# EAGLE schematic ESP32_Display_2.1(K)_Main_V1.0 (EAGLE 9.6.2)
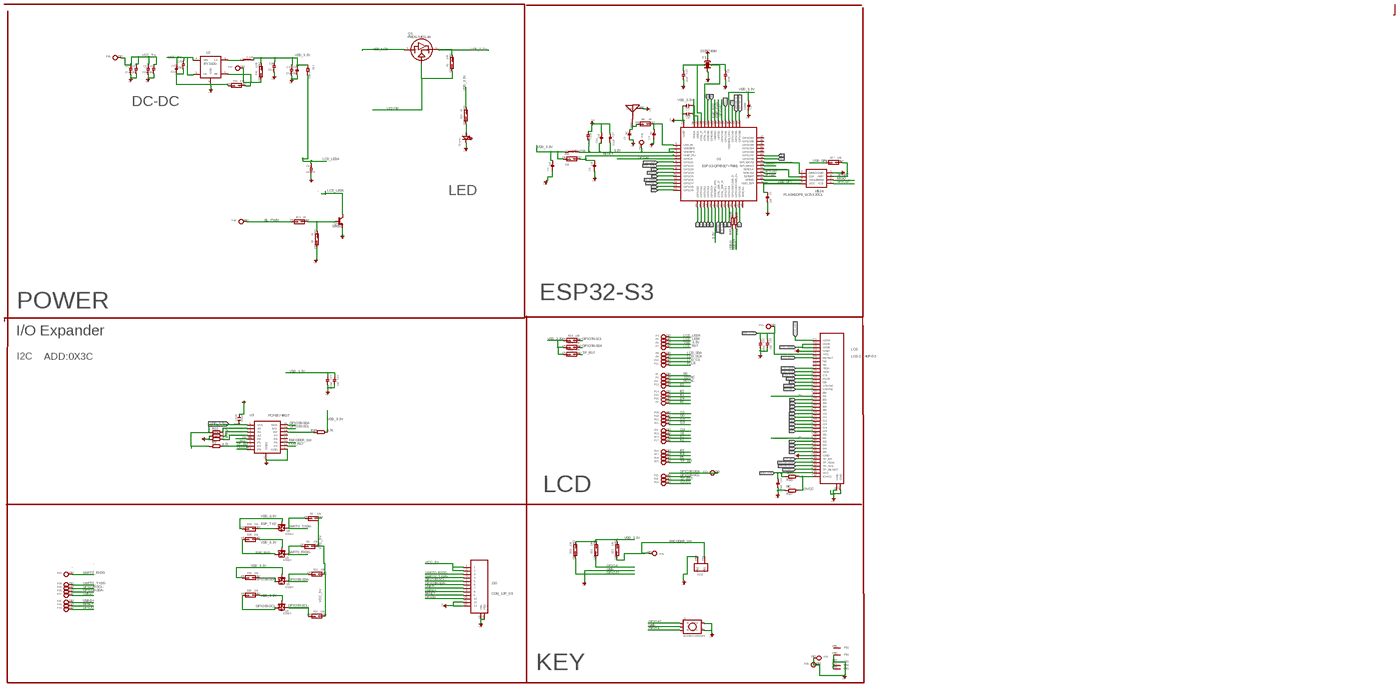
[diagram p0: schematic, sheet 1, overview]
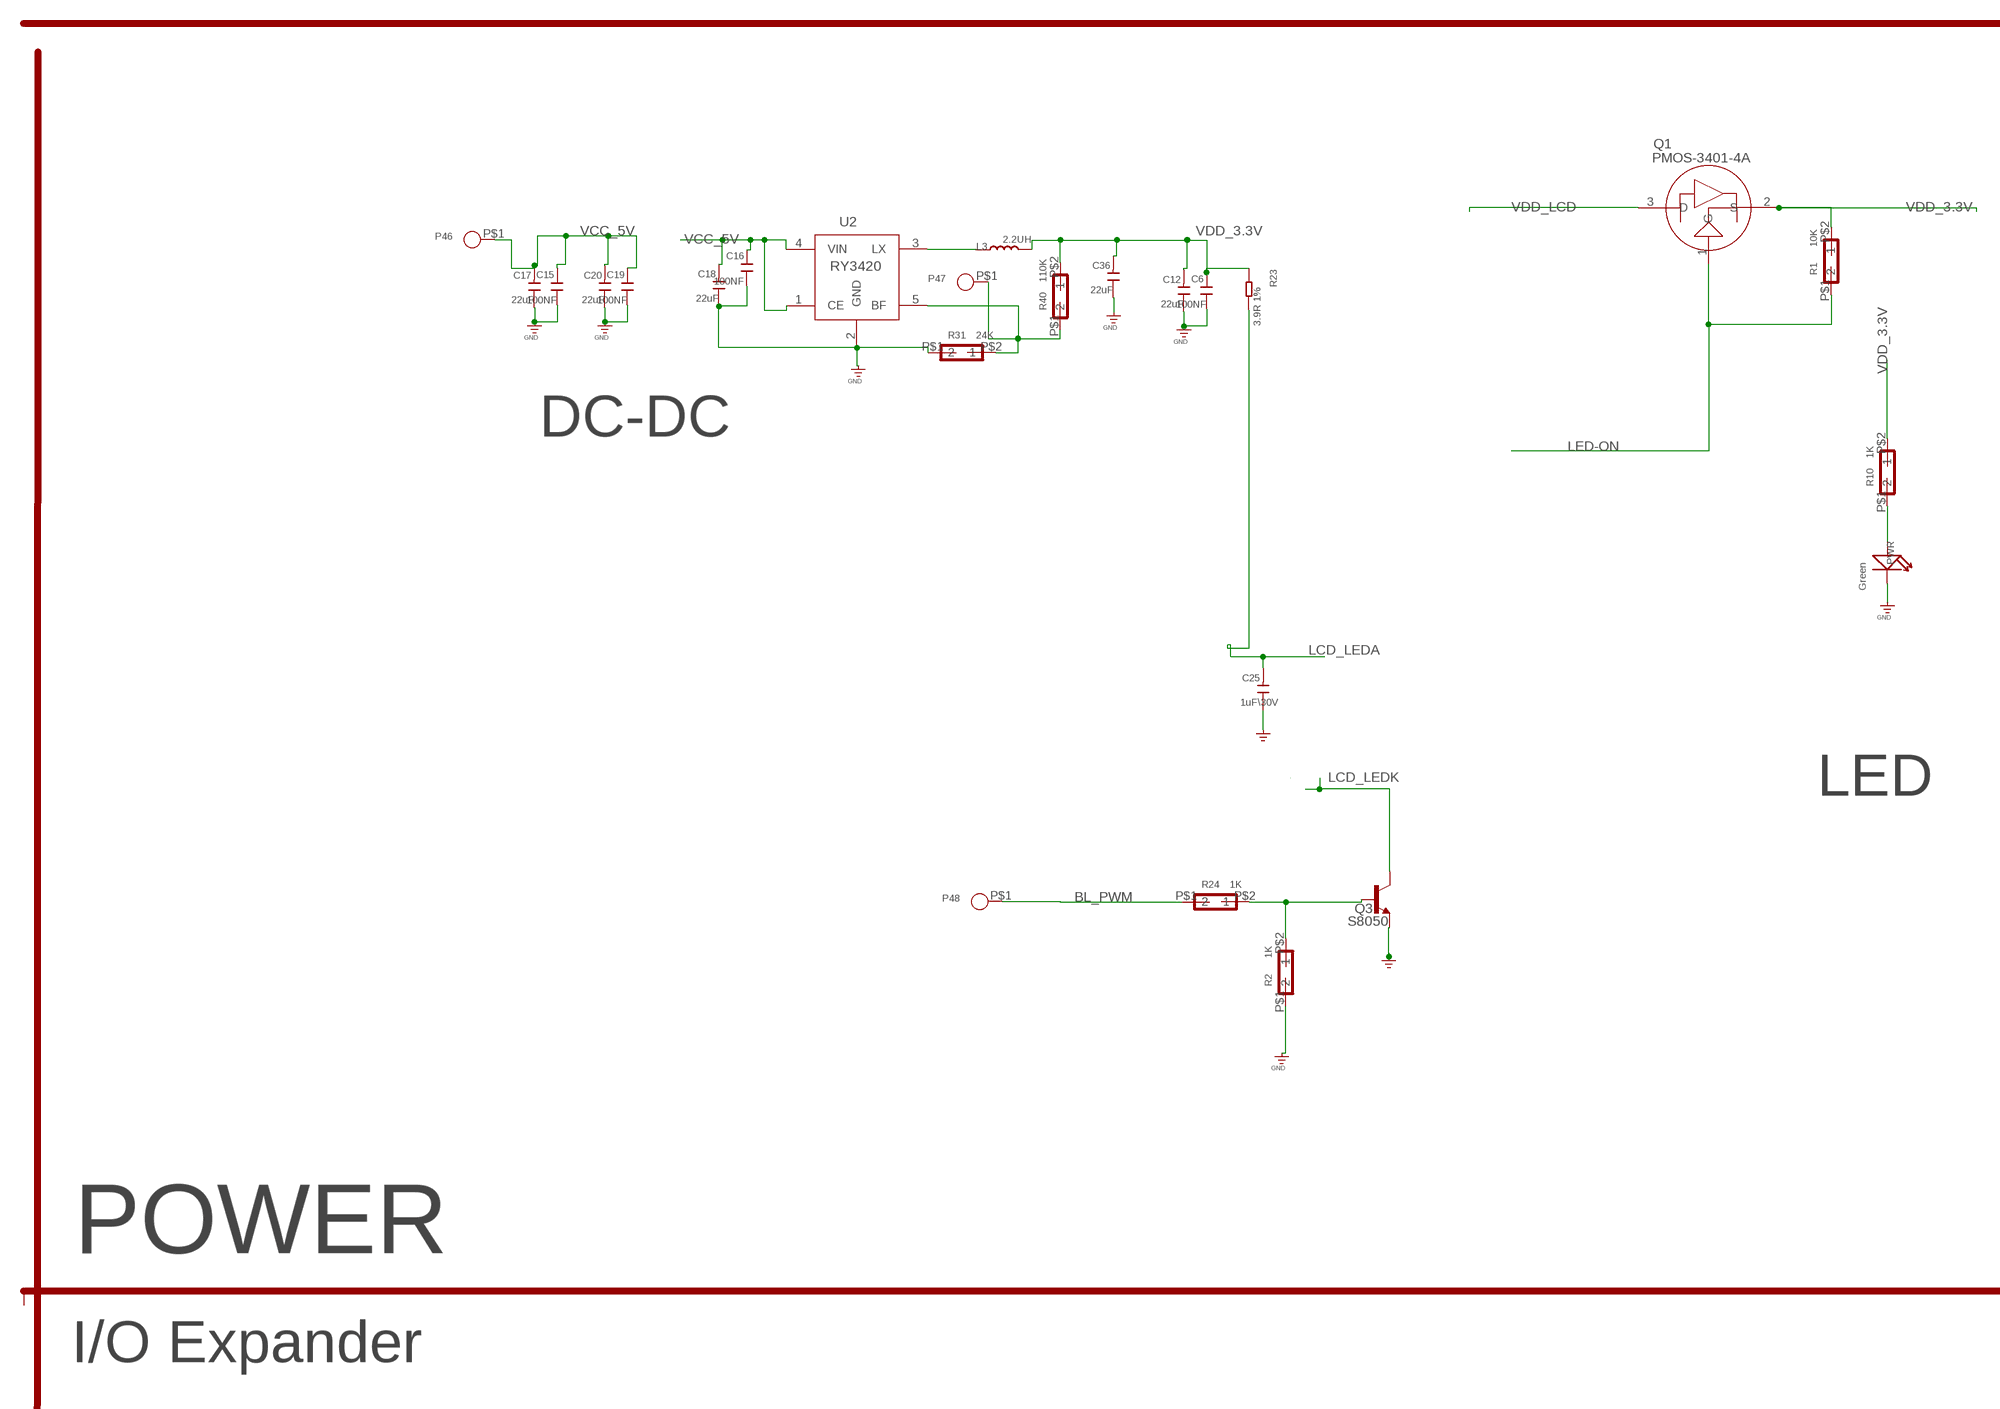
[diagram p1: schematic, sheet 1, part 1 of 5]
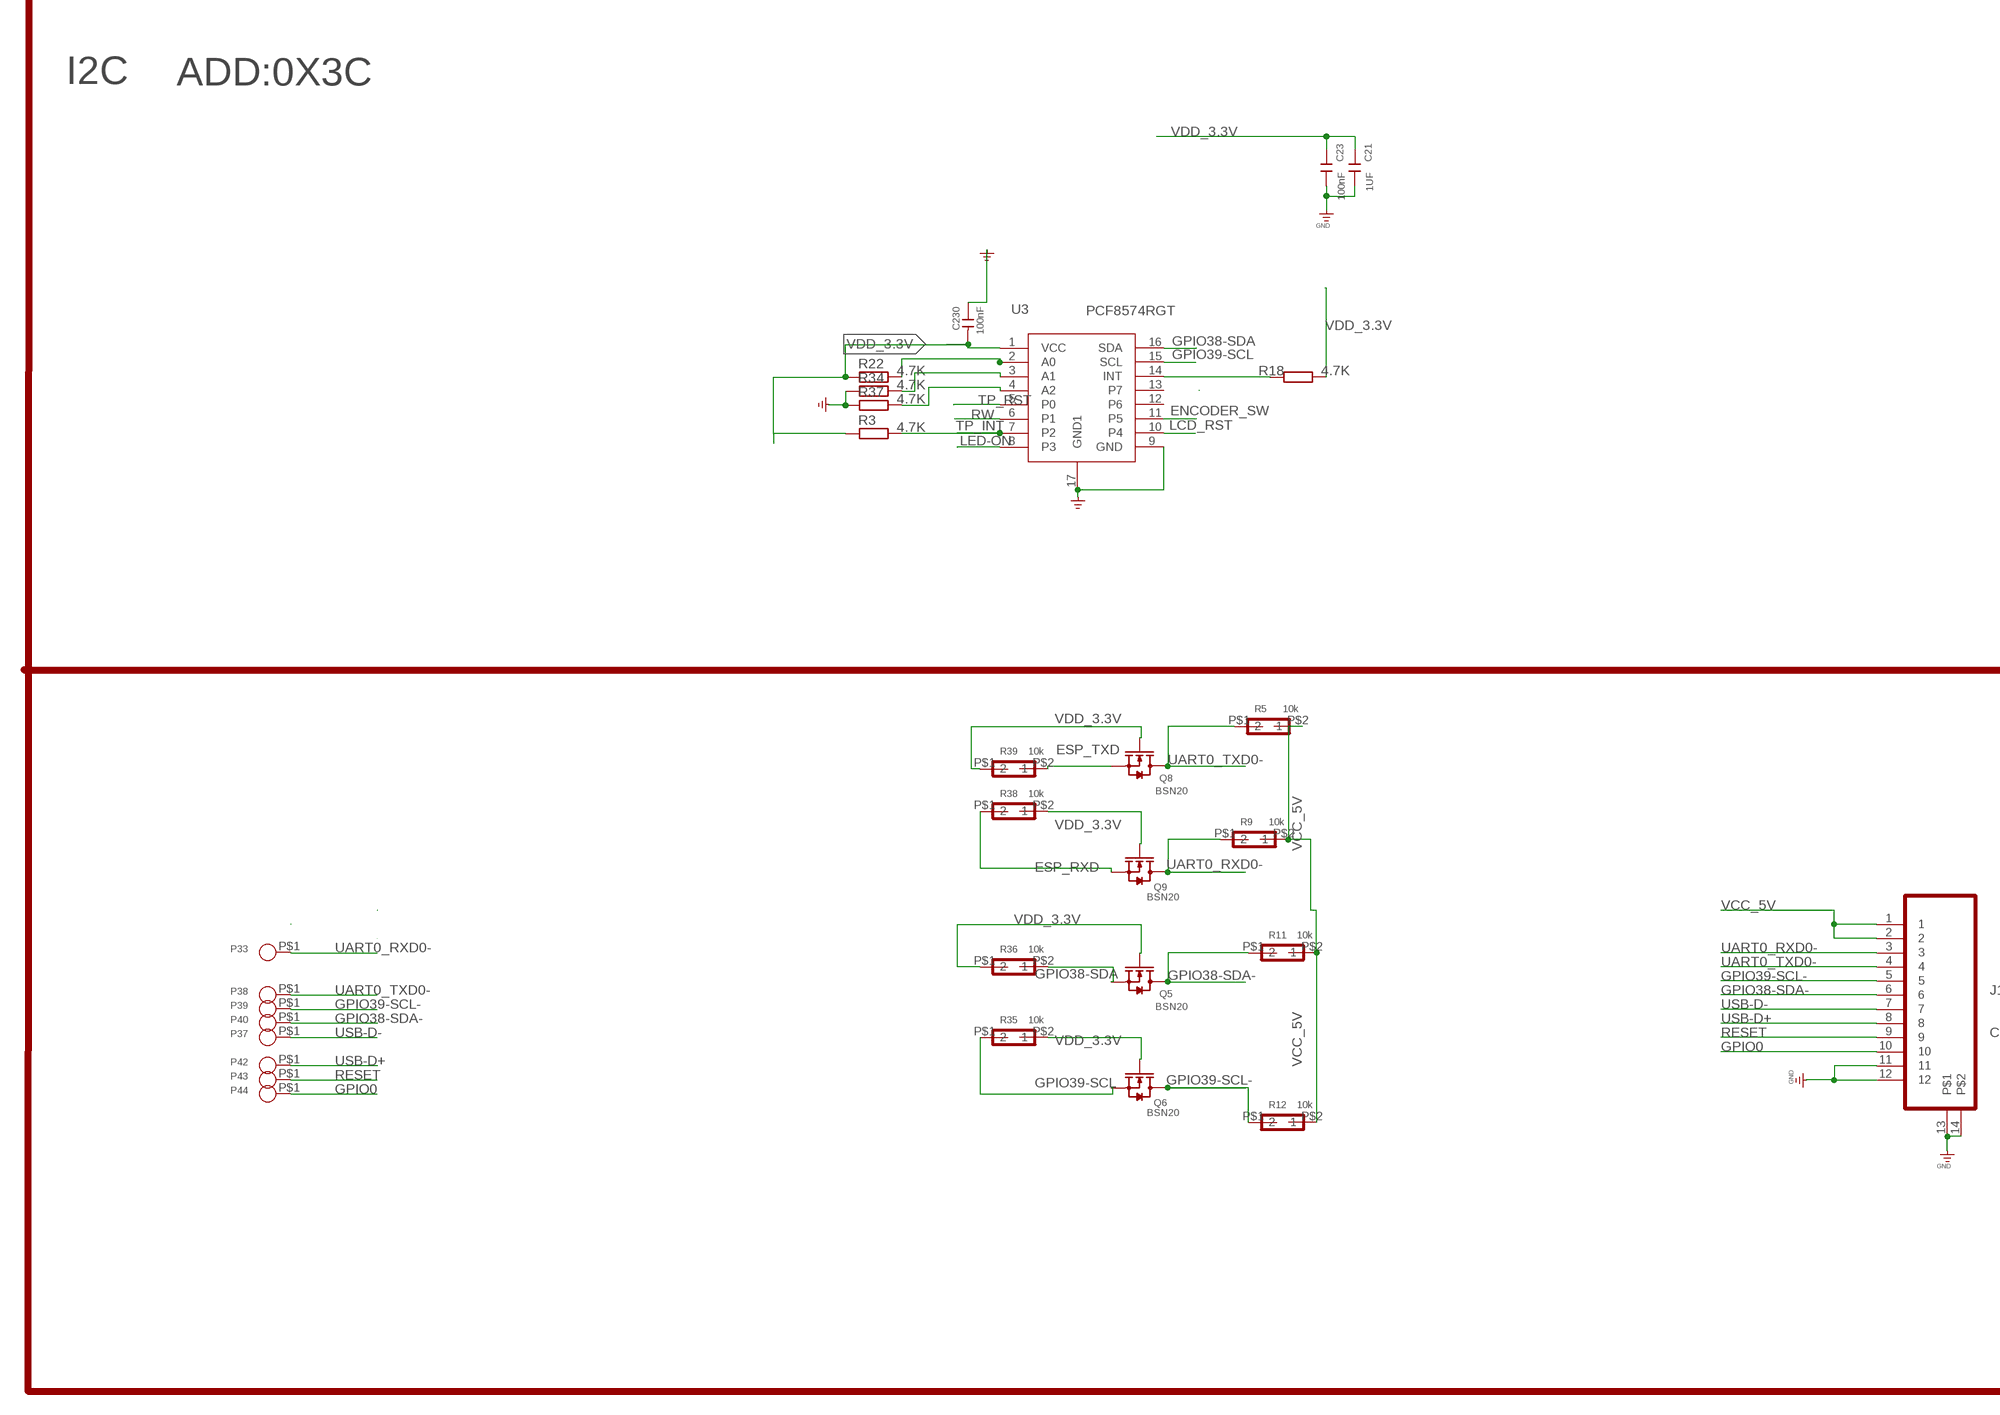
[diagram p2: schematic, sheet 1, part 2 of 5]
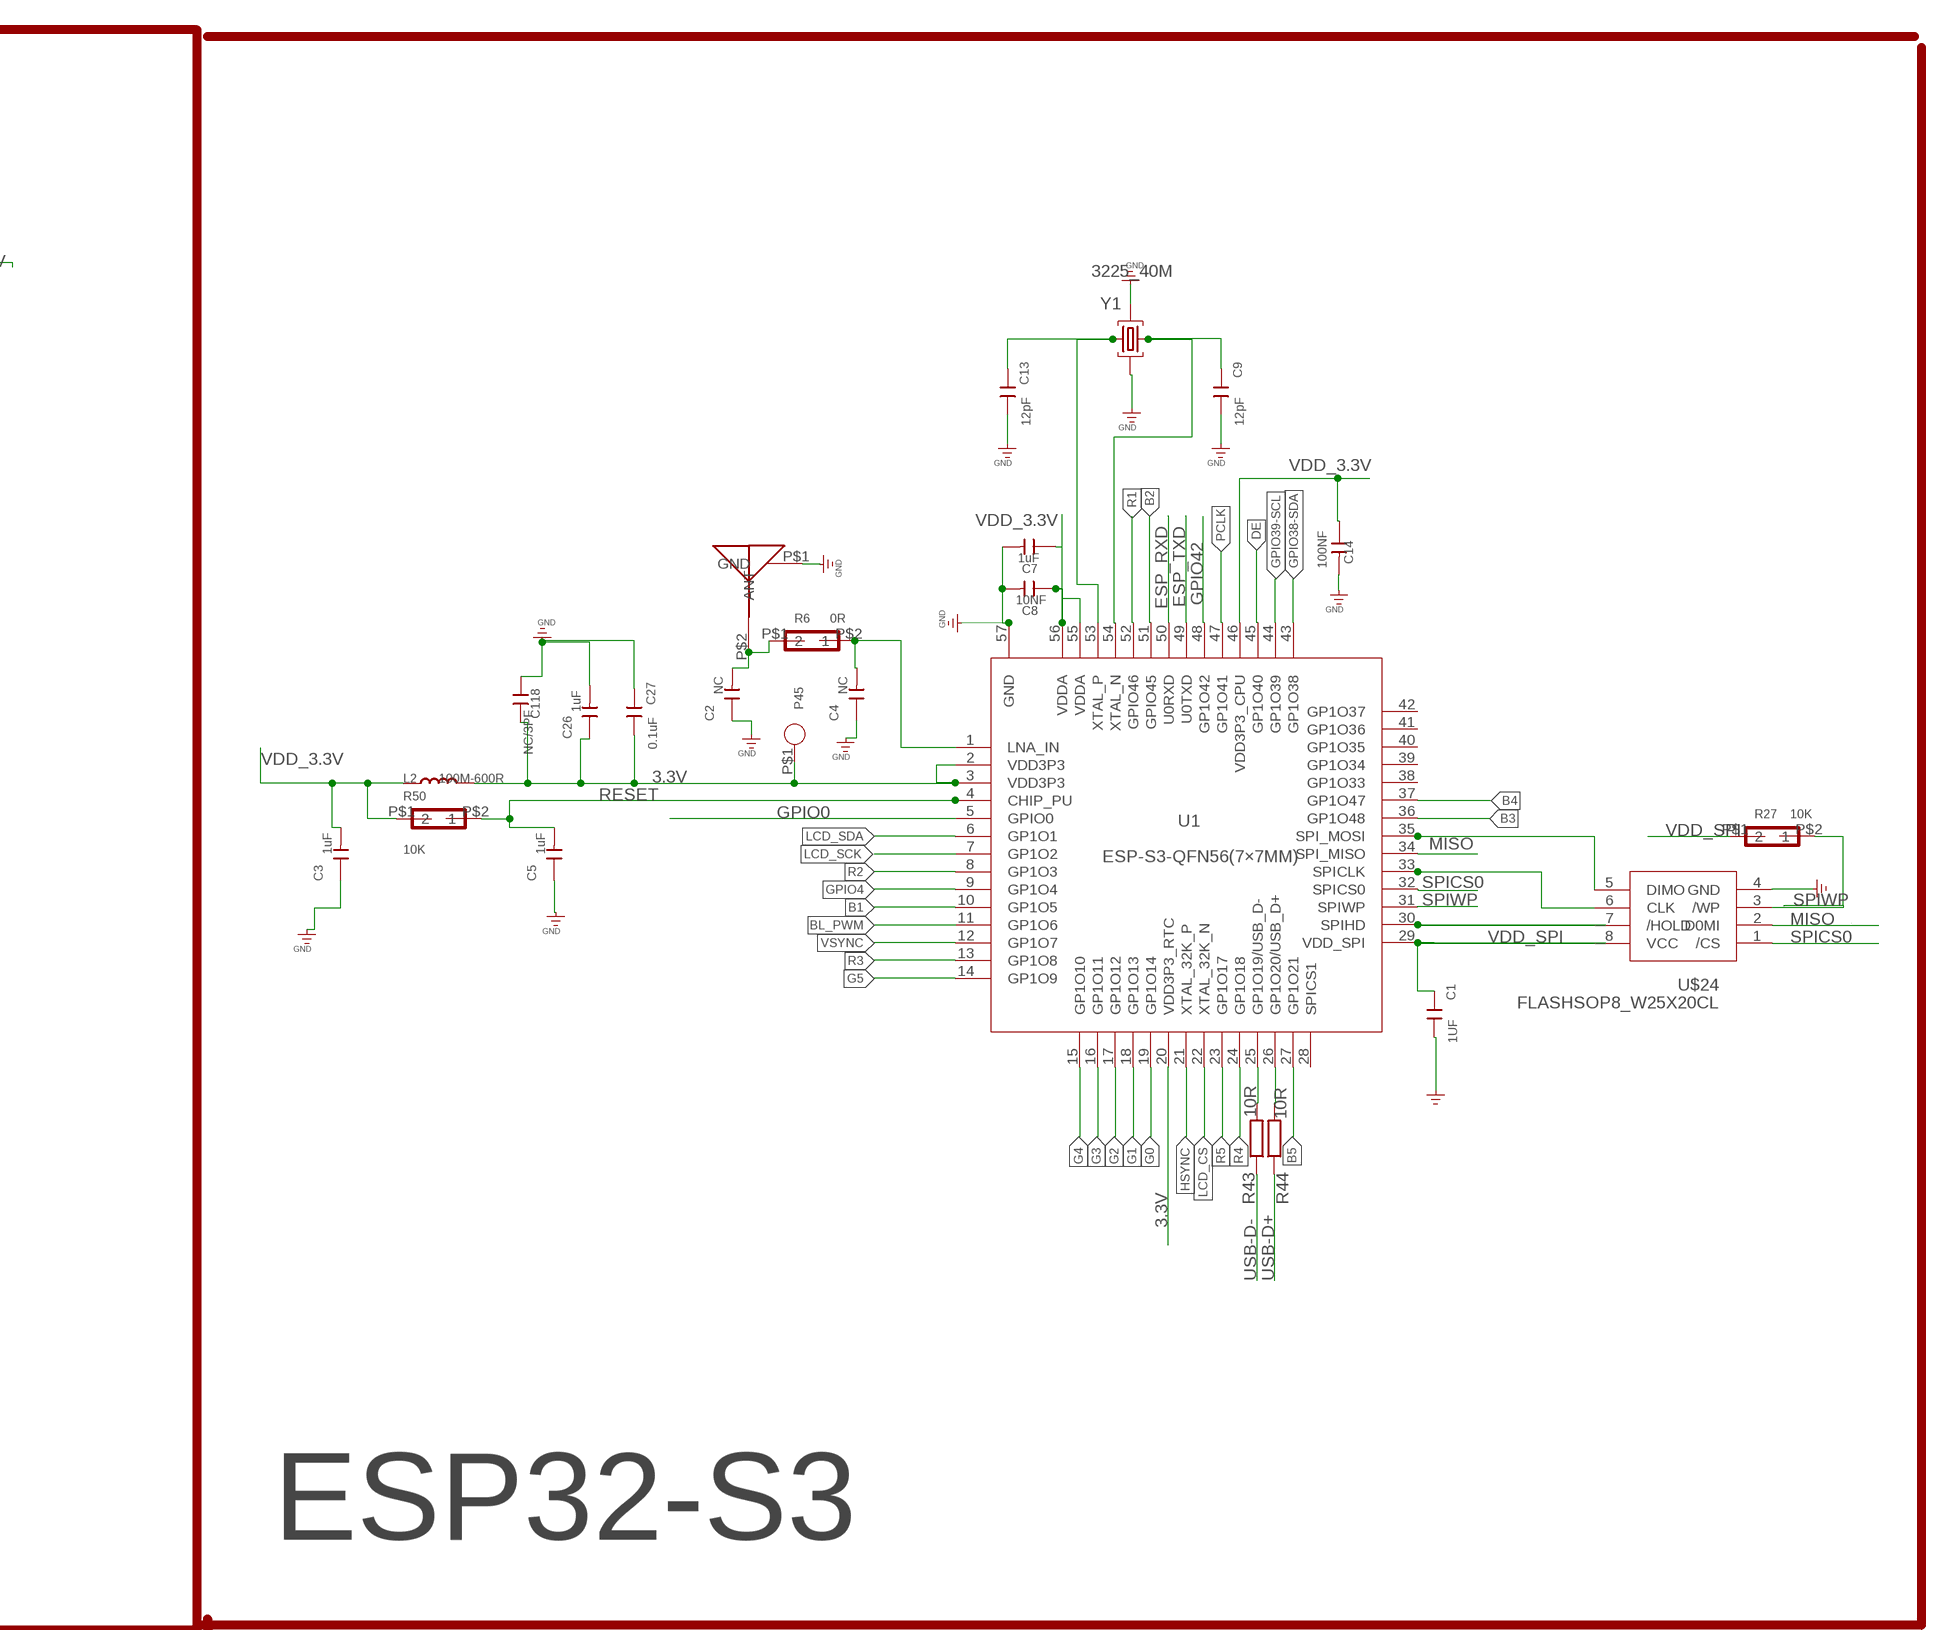
[diagram p3: schematic, sheet 1, part 3 of 5]
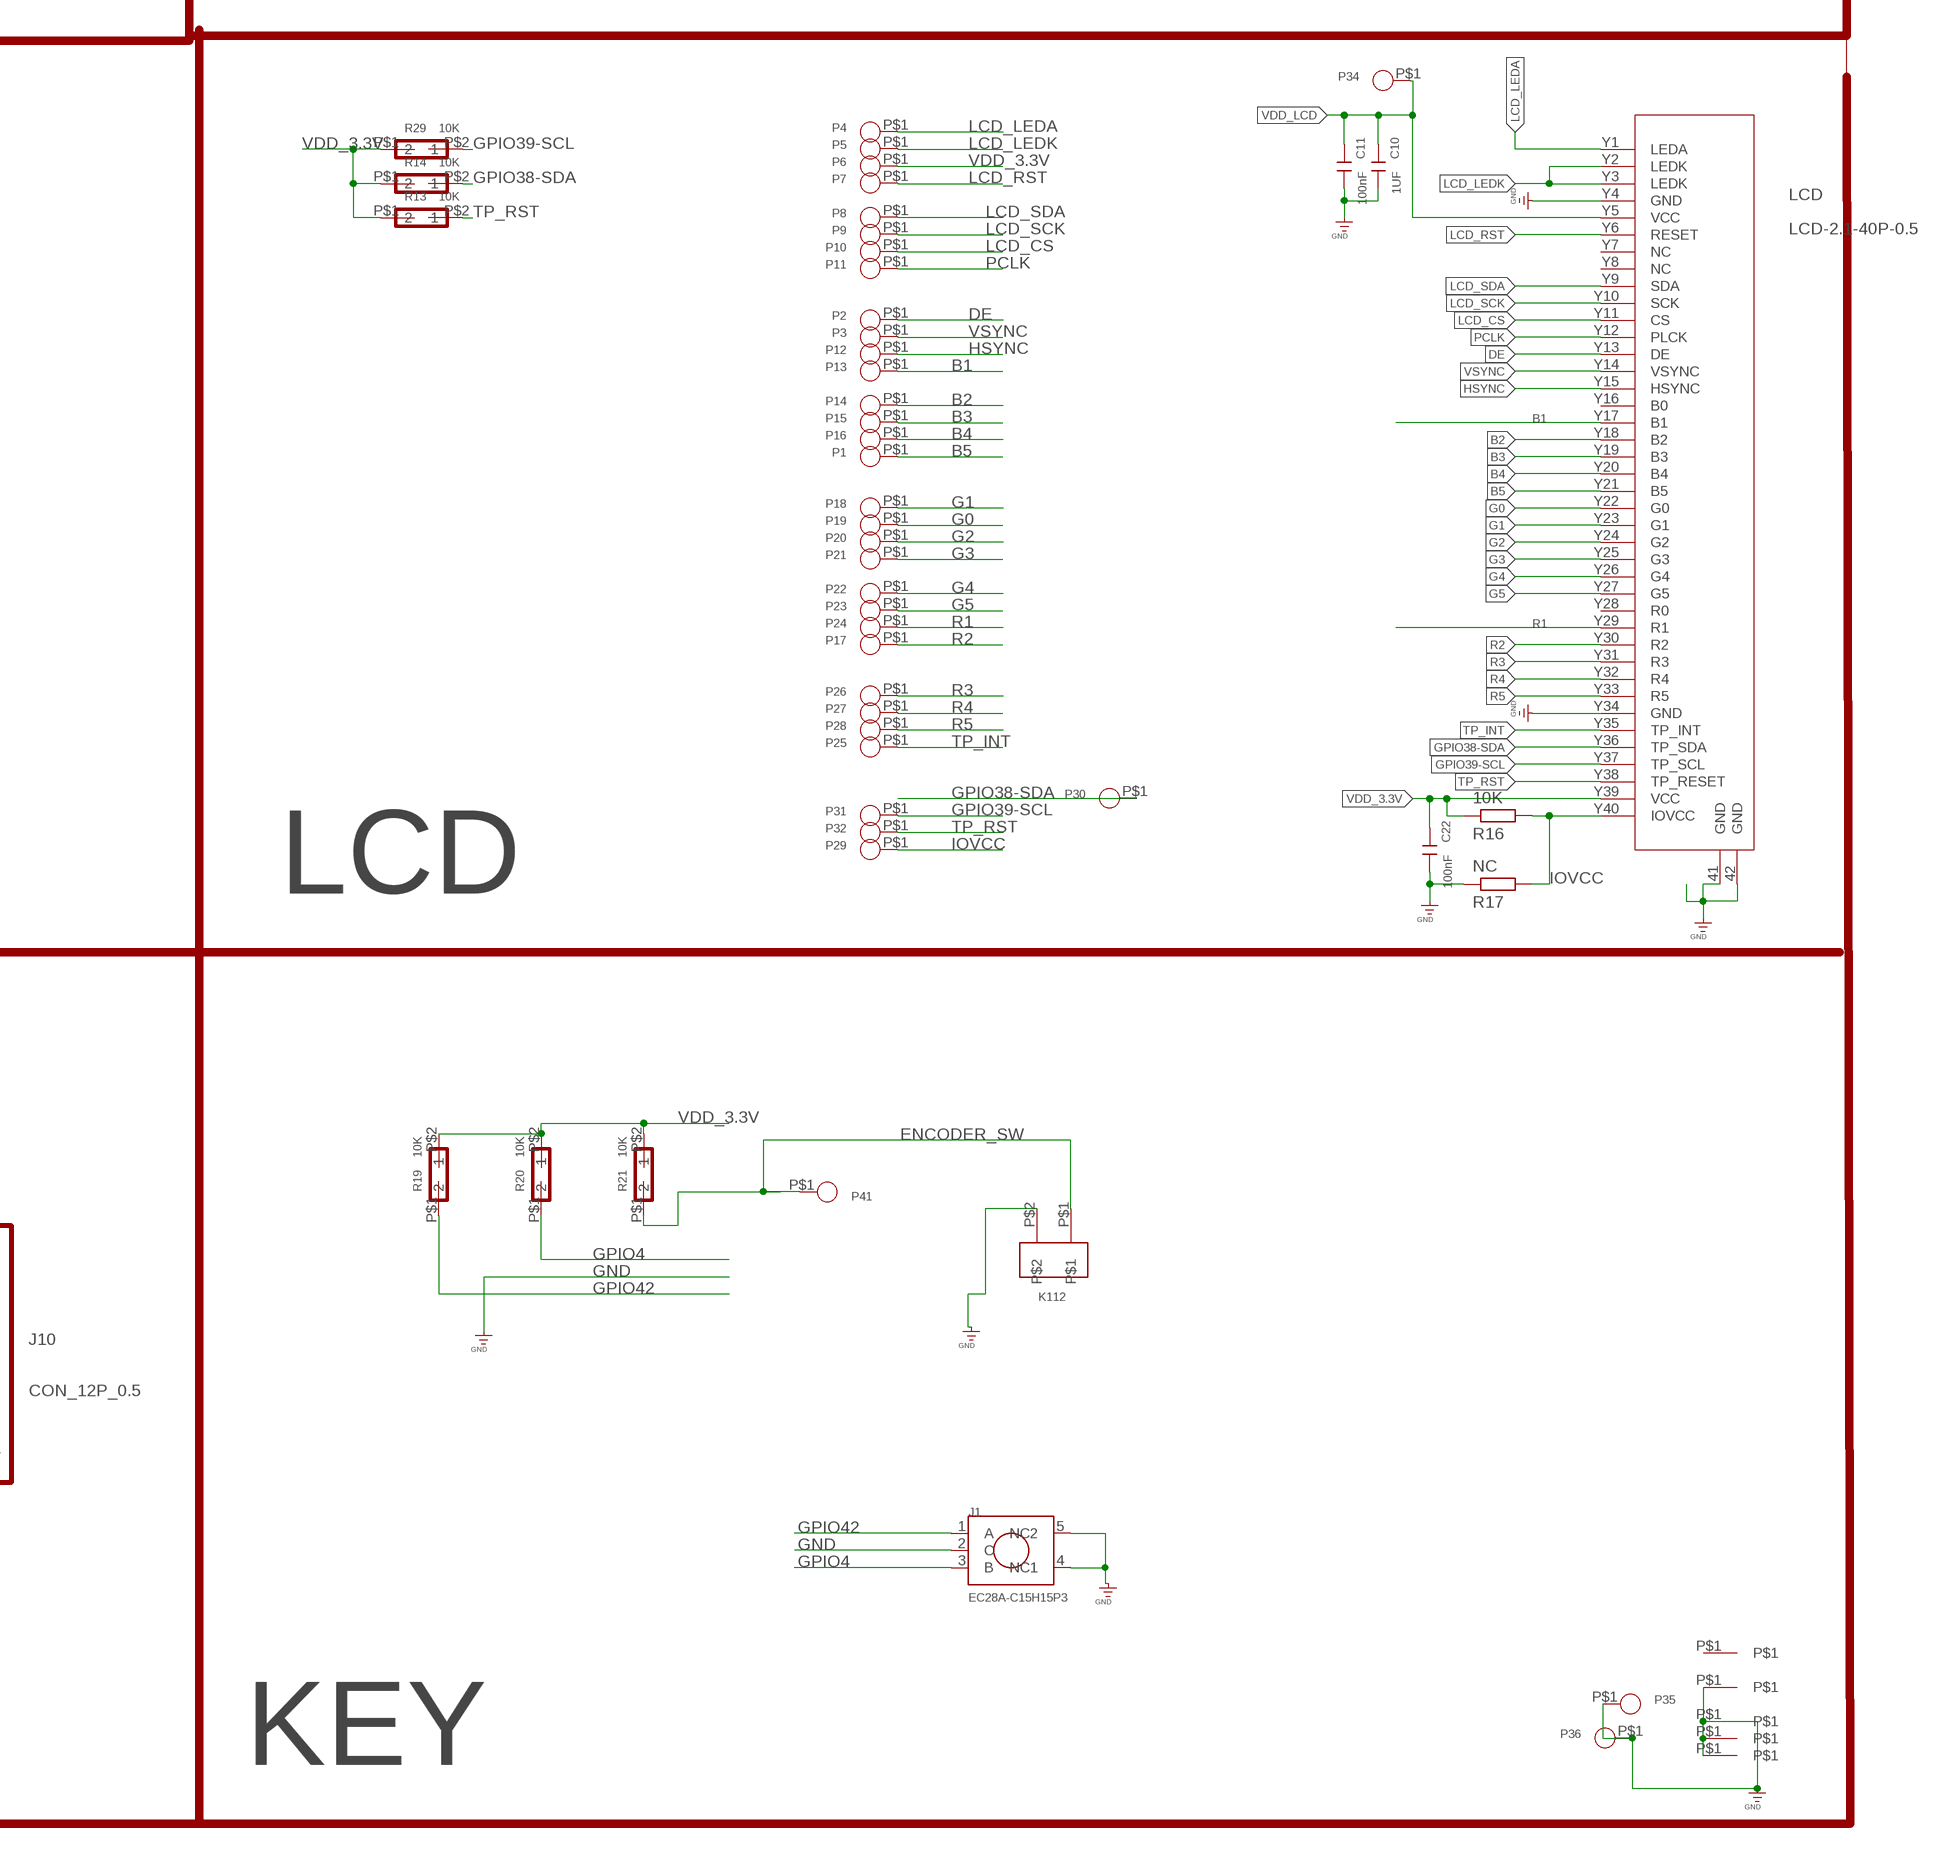
[diagram p4: schematic, sheet 1, part 4 of 5]
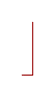
[diagram p5: schematic, sheet 1, part 5 of 5]

## Parts
ANT  BT_ANT  [BT_ANT]
C1  1UF  C0402_W  [0402]
C2  NC  CAPC0402-1  [C0402]
C3  1uF  CAPC0402-1  [C0402]
C4  NC  CAPC0402-1  [C0402]
C5  1uF  CAPC0402-1  [C0402]
C6  100NF  C0603  [0603]
C7  1uF  C-0603  [C0603]
C8  10NF  C-0603  [C0603]
C9  12pF  C0402_W  [0402]
C10  1UF  C0402_W  [0402]
C11  100nF  C0402_W  [0402]
C12  22uF  C0805  [0805]
C13  12pF  C0402_W  [0402]
C14  100NF  C-0603  [C0603]
C15  100NF  C0603  [0603]
C16  100NF  C0603  [0603]
C17  22uF  C0805  [0805]
C18  22uF  C0805  [0805]
C19  100NF  C0603  [0603]
C20  22uF  C0805  [0805]
C21  1UF  C0402_W  [0402]
C22  100nF  C0402_W  [0402]
C23  100nF  C0402_W  [0402]
C25  1uF\30V  C0805  [0805]
C26  1uF  CAPC0402-1  [C0402]
C27  0.1uF  C0402_W  [0402]
C36  22uF  C0805  [0805]
C118  NC/3PF  C0603  [0603]
C230  100nF  CAPC0603  [C0603]
J1  EC28A-C15H15P3  [EC28A-C15H15P3]
J10  CON_12P_0.5  [0.5MM-12P]
K112  BUTTON_2P  [BUTTON_2P]
L2  100M-600R  L0603  [L0603]
L3  2.2UH  LL0420  [L0420]
LCD  LCD-2.1-40P-0.5  [0.5MM-40P]
P1  PADPAD-1.0MM  [PAD-1.0MM]
P2  PADPAD-1.0MM  [PAD-1.0MM]
P3  PADPAD-1.0MM  [PAD-1.0MM]
P4  PADPAD-1.0MM  [PAD-1.0MM]
P5  PADPAD-1.0MM  [PAD-1.0MM]
P6  PADPAD-1.0MM  [PAD-1.0MM]
P7  PADPAD-1.0MM  [PAD-1.0MM]
P8  PADPAD-1.0MM  [PAD-1.0MM]
P9  PADPAD-1.0MM  [PAD-1.0MM]
P10  PADPAD-1.0MM  [PAD-1.0MM]
P11  PADPAD-1.0MM  [PAD-1.0MM]
P12  PADPAD-1.0MM  [PAD-1.0MM]
P13  PADPAD-1.0MM  [PAD-1.0MM]
P14  PADPAD-1.0MM  [PAD-1.0MM]
P15  PADPAD-1.0MM  [PAD-1.0MM]
P16  PADPAD-1.0MM  [PAD-1.0MM]
P17  PADPAD-1.0MM  [PAD-1.0MM]
P18  PADPAD-1.0MM  [PAD-1.0MM]
P19  PADPAD-1.0MM  [PAD-1.0MM]
P20  PADPAD-1.0MM  [PAD-1.0MM]
P21  PADPAD-1.0MM  [PAD-1.0MM]
P22  PADPAD-1.0MM  [PAD-1.0MM]
P23  PADPAD-1.0MM  [PAD-1.0MM]
P24  PADPAD-1.0MM  [PAD-1.0MM]
P25  PADPAD-1.0MM  [PAD-1.0MM]
P26  PADPAD-1.0MM  [PAD-1.0MM]
P27  PADPAD-1.0MM  [PAD-1.0MM]
P28  PADPAD-1.0MM  [PAD-1.0MM]
P29  PADPAD-1.0MM  [PAD-1.0MM]
P30  PADPAD-1.0MM  [PAD-1.0MM]
P31  PADPAD-1.0MM  [PAD-1.0MM]
P32  PADPAD-1.0MM  [PAD-1.0MM]
P33  PADPAD-1.0MM  [PAD-1.0MM]
P34  PADPAD-1.0MM  [PAD-1.0MM]
P35  PADPAD-1.0MM  [PAD-1.0MM]
P36  PADPAD-1.0MM  [PAD-1.0MM]
P37  PADPAD-1.0MM  [PAD-1.0MM]
P38  PADPAD-1.0MM  [PAD-1.0MM]
P39  PADPAD-1.0MM  [PAD-1.0MM]
P40  PADPAD-1.0MM  [PAD-1.0MM]
P41  PADPAD-1.0MM  [PAD-1.0MM]
P42  PADPAD-1.0MM  [PAD-1.0MM]
P43  PADPAD-1.0MM  [PAD-1.0MM]
P44  PADPAD-1.0MM  [PAD-1.0MM]
P45  PADPAD-1.0MM  [PAD-1.0MM]
P46  PADPAD-1.0MM  [PAD-1.0MM]
P47  PADPAD-1.0MM  [PAD-1.0MM]
P48  PADPAD-1.0MM  [PAD-1.0MM]
PWR  Green  LED'0603'  [LED-0603]
Q1  PMOS-3401-4A  P-MOS-SOT23  [SOT-23]
Q3  S8050  SPARKFUN_TRANSISTOR_NPNSOT23  [SPARKFUN_SOT23]
Q5  BSN20  MOSFET-N'SOT23'  [SOT23]
Q6  BSN20  MOSFET-N'SOT23'  [SOT23]
Q8  BSN20  MOSFET-N'SOT23'  [SOT23]
Q9  BSN20  MOSFET-N'SOT23'  [SOT23]
R1  10K  R0402  [0402]
R2  1K  R0402  [0402]
R3  4.7K  R-EU_R0402  [R0402]
R5  10k  R0402  [0402]
R6  0R  R0402  [0402]
R9  10k  R0402  [0402]
R10  1K  R0402  [0402]
R11  10k  R0402  [0402]
R12  10k  R0402  [0402]
R13  10K  R0402  [0402]
R14  10K  R0402  [0402]
R16  10K  R-EU_R0402  [R0402]
R17  NC  R-EU_R0402  [R0402]
R18  4.7K  R-EU_R0402  [R0402]
R19  10K  R0402  [0402]
R20  10K  R0402  [0402]
R21  10K  R0402  [0402]
R22  4.7K  R-EU_R0402  [R0402]
R23  3.9R 1%  DISCRETE_R-0603  [DISCRETE_R0603]
R24  1K  R0402  [0402]
R27  10K  R0402  [0402]
R29  10K  R0402  [0402]
R31  24K  R0402  [0402]
R34  4.7K  R-EU_R0402  [R0402]
R35  10k  R0402  [0402]
R36  10k  R0402  [0402]
R37  4.7K  R-EU_R0402  [R0402]
R38  10k  R0402  [0402]
R39  10k  R0402  [0402]
R40  110K  R0402  [0402]
R43  10R  R-EU_R0402  [R0402]
R44  10R  R-EU_R0402  [R0402]
R50  10K  R0402  [0402]
U1  ESP-S3-QFN56(7×7MM)  [ESP-S3-QFN56(7×7MM)]
U2  RY3420  HX3406  [SOT23-5]
U3  PCF8574RGT  [QFN16-3*3]
U$9  T-2-1.1  [T-2-1.1]
U$19  T-2-1.1  [T-2-1.1]
U$24  FLASHSOP8_W25X20CL  [FLASHSOP8_SOP8]
U$29  T-2-1.1  [T-2-1.1]
U$30  T-2-1.1  [T-2-1.1]
U$32  T-2-1.1  [T-2-1.1]
Y1  3225_40M  CRYSTAL-3.2-2.5  [CRYSTAL-3.2-2.5]

## Nets
3.3V: C26.1 C27.2 C118.2 L2.2 P45.P$1 U1.2(VDD3P3) U1.3(VDD3P3) U1.20(VDD3P3_RTC)
B1: LCD.Y17(B1) P13.P$1 U1.10(GP1O5)
B2: LCD.Y18(B2) P14.P$1 U1.51(GPIO45)
B3: LCD.Y19(B3) P15.P$1 U1.36(GP1O48)
B4: LCD.Y20(B4) P16.P$1 U1.37(GP1O47)
B5: LCD.Y21(B5) P1.P$1 U1.27(GP1O21)
BL_PWM: P48.P$1 R24.P$1 U1.11(GP1O6)
DE: LCD.Y13(DE) P2.P$1 U1.45(GP1O40)
ENCODER_A: U3.12(P6)
ENCODER_SW: K112.P$1 P41.P$1 R21.P$1 U3.11(P5)
ESP_RXD: Q9.2(S) R38.P$1 U1.50(U0RXD)
ESP_TXD: Q8.2(S) R39.P$2 U1.49(U0TXD)
G0: LCD.Y22(G0) P19.P$1 U1.19(GP1O14)
G1: LCD.Y23(G1) P18.P$1 U1.18(GP1O13)
G2: LCD.Y24(G2) P20.P$1 U1.17(GP1O12)
G3: LCD.Y25(G3) P21.P$1 U1.16(GP1O11)
G4: LCD.Y26(G4) P22.P$1 U1.15(GP1O10)
G5: LCD.Y27(G5) P23.P$1 U1.14(GP1O9)
GND: ANT.P$1(GND) C1.2 C2.1 C3.1 C4.1 C5.1 C6.2 C7.2 C8.2 C9.2 C10.2 C11.2 C12.1 C13.2 C14.2 C15.2 C16.2 C17.1 C18.1 C19.2 C20.1 C21.2 C22.2 C23.2 C25.1 C26.2 C27.1 C36.1 C118.1 C230.1 J1.2(C) J1.4(NC1) J1.5(NC2) J10.11 J10.12 J10.13 J10.14 K112.P$2 LCD.41(GND) LCD.42(GND) LCD.Y4(GND) LCD.Y34(GND) P35.P$1 P36.P$1 PWR.- Q3.2(E) R2.P$1 R17.2 R31.P$1 R34.2 R37.2 U1.57(GND) U2.2(GND) U3.9(GND) U3.17(GND1) U$9.P$1 U$19.P$1 U$24.4(GND) U$29.P$1 U$32.P$1 Y1.2(GND) Y1.4(GND)
GPIO0: J10.10 P44.P$1 U1.5(GPIO0)
GPIO4: J1.3(B) R20.P$1 U1.9(GP1O4)
GPIO38-SDA: LCD.Y36(TP_SDA) P30.P$1 Q5.2(S) R14.P$2 R36.P$2 U1.43(GP1O38) U3.16(SDA)
GPIO38-SDA-: J10.6 P40.P$1 Q5.3(D) R11.P$1
GPIO39-SCL: LCD.Y37(TP_SCL) P31.P$1 Q6.2(S) R29.P$2 R35.P$1 U1.44(GP1O39) U3.15(SCL)
GPIO39-SCL-: J10.5 P39.P$1 Q6.3(D) R12.P$1
GPIO42: J1.1(A) R19.P$1 U1.48(GP1O42)
HSYNC: LCD.Y15(HSYNC) P12.P$1 U1.21(XTAL_32K_P)
IOVCC: LCD.Y40(IOVCC) P29.P$1 R16.1 R17.1
LCD_CS: LCD.Y11(CS) P10.P$1 U1.22(XTAL_32K_N)
LCD_LEDA: C25.2 LCD.Y1(LEDA) P4.P$1 R23.2
LCD_LEDK: LCD.Y2(LEDK) LCD.Y3(LEDK) P5.P$1 Q3.3(C)
LCD_RST: LCD.Y6(RESET) P7.P$1 U3.10(P4)
LCD_SCK: LCD.Y10(SCK) P9.P$1 U1.7(GP1O2)
LCD_SDA: LCD.Y9(SDA) P8.P$1 U1.6(GP1O1)
LED-ON: Q1.1(G) R1.P$1 U3.8(P3)
MISO: U1.34(SPI_MISO) U$24.2(D0MI)
N$3: L3.1 U2.3(LX)
N$4: R22.1 U3.2(A0)
N$5: PWR.+ R10.P$1
N$7: ANT.P$2(ANT) C2.2 R6.P$1
N$10: R43.2 U1.25(GP1O19/USB_D-)
N$14: P47.P$1 R31.P$2 R40.P$1 U2.5(BF)
N$16: R44.2 U1.26(GP1O20/USB_D+)
N$17: R34.1 U3.3(A1)
N$18: R37.1 U3.4(A2)
N$19: R18.2 U3.14(INT)
N$20: Q3.1(B) R2.P$2 R24.P$2
N$117: U1.30(SPIHD) U$24.7(/HOLD)
N$198: C4.2 R6.P$2 U1.1(LNA_IN)
N$199: U1.33(SPICLK) U$24.6(CLK)
N$200: U1.35(SPI_MOSI) U$24.5(DIMO)
N$201: C13.1 U1.53(XTAL_P) Y1.3(C2)
N$202: C9.1 U1.54(XTAL_N) Y1.1(C1)
PCLK: LCD.Y12(PLCK) P11.P$1 U1.47(GP1O41)
R1: LCD.Y29(R1) P24.P$1 U1.52(GPIO46)
R2: LCD.Y30(R2) P17.P$1 U1.8(GP1O3)
R3: LCD.Y31(R3) P26.P$1 U1.13(GP1O8)
R4: LCD.Y32(R4) P27.P$1 U1.24(GP1O18)
R5: LCD.Y33(R5) P28.P$1 U1.23(GP1O17)
RESET: C5.2 J10.9 P43.P$1 R50.P$2 U1.4(CHIP_PU)
RW: U3.6(P1)
SPICS0: U1.32(SPICS0) U$24.1(/CS)
SPIWP: R27.P$2 U1.31(SPIWP) U$24.3(/WP)
TP_INT: LCD.Y35(TP_INT) P25.P$1 R3.1 U3.7(P2)
TP_RST: LCD.Y38(TP_RESET) P32.P$1 R13.P$2 U3.5(P0)
UART0_RXD0-: J10.3 P33.P$1 Q9.3(D) R9.P$1
UART0_TXD0-: J10.4 P38.P$1 Q8.3(D) R5.P$1
USB-D+: J10.8 P42.P$1 R44.1
USB-D-: J10.7 P37.P$1 R43.1
VCC_5V [PWR]: C15.1 C16.1 C17.2 C18.2 C19.1 C20.2 J10.1 J10.2 P46.P$1 R5.P$2 R9.P$2 R11.P$2 R12.P$2 U2.1(CE) U2.4(VIN)
VDD_3.3V: C3.2 C6.1 C7.1 C8.1 C12.2 C14.1 C21.1 C22.1 C23.1 C36.2 C230.2 L2.1 L3.2 LCD.Y39(VCC) P6.P$1 Q1.2(S) Q5.1(G) Q6.1(G) Q8.1(G) Q9.1(G) R1.P$2 R3.2 R10.P$2 R13.P$1 R14.P$1 R16.2 R18.1 R19.P$2 R20.P$2 R21.P$2 R22.2 R23.1 R29.P$1 R35.P$2 R36.P$1 R38.P$2 R39.P$1 R40.P$2 R50.P$1 U1.46(VDD3P3_CPU) U1.55(VDDA) U1.56(VDDA) U3.1(VCC)
VDD_LCD: C10.1 C11.1 LCD.Y5(VCC) P34.P$1 Q1.3(D)
VDD_SPI: C1.1 R27.P$1 U1.29(VDD_SPI) U$24.8(VCC)
VSYNC: LCD.Y14(VSYNC) P3.P$1 U1.12(GP1O7)
Unconnected: LCD.Y7(NC) LCD.Y8(NC) LCD.Y16(B0) LCD.Y28(R0) U1.28(SPICS1) U1.38(GP1O33) U1.39(GP1O34) U1.40(GP1O35) U1.41(GP1O36) U1.42(GP1O37) U3.13(P7) U$30.P$1

## Notes on the sheet
- DC-DC
- LED
- ESP32-S3
- POWER
- I/O Expander
- I2C | ADD:0X3C
- LCD
- KEY

## Library data of the parts
ANT = BT_ANT:BT_ANT
C1 C9-C11 C13 C21-C23 C27 = WGH:C0402_W
C2-C5 C26 = CrowPanel_Advance_HMI:CAP*
C6 C15 C16 C19 C118 = cooper:C0603
C7 C8 C14 = Discrete:C*: Ceramic Capacitors
C12 C17 C18 C20 C25 C36 = A_xbj:C0805
C230 = Brian:CAP*
J1 = ESP32_Display_K:EC28A-C15H15P3
J10 = DW1000:CON_12P_0.5
K112 = crowpi_pow:BUTTON_2P
L2 L3 = Lora_RA-08H_Node_ Board:L*
LCD = DW1000:LCD-2.1-40P-0.5
P1-P48 = crowpi_pow:PAD*
PWR = discrete:LED*
Q1 = DFN8:P-MOS-SOT23
Q3 = Adafruit_HUZZAH32_ESP32_Feather:SPARKFUN_TRANSISTOR_NPN: Transistor NPN BJT configuration in SOT23 package. MMBT2222 is the common NPN we use. Double check BCE configuration again layout.
Q5 Q6 Q8 Q9 = discrete:MOSFET-N: IRLL014: http://www.vishay.com/docs/91319/sihll014.pdf
R1 R2 R5 R6 R9-R14 R19-R21 R24 R27 R29 R31 R35 R36 R38-R40 R50 = DW1000:R0402
R3 R16-R18 R22 R34 R37 R43 R44 = rcl:R-EU_: RESISTOR, European symbol; SPICEPREFIX: R
R23 = Crowtail-_LED-V2.0-20190615-01:DISCRETE_R*
U1 = DA14580_40p:ESP-S3-QFN56(7×7MM)
U2 = DFN8:HX3406
U3 = MY_LIB:PCF8574RGT
U$9 U$19 U$29 U$30 U$32 = DW1000:T-2-1.1
U$24 = ESP32 Display-1.28:FLASHSOP8_W25X20CL
Y1 = SmartPrj:CRYSTAL-3.2-2.5

## Net classes
0 default: clearance 0.12 mm
1 PWR: width 0.254 mm, clearance 0.12 mm to class 0, clearance 0.12 mm